# EAGLE schematic AWS (EAGLE 7.6.0)
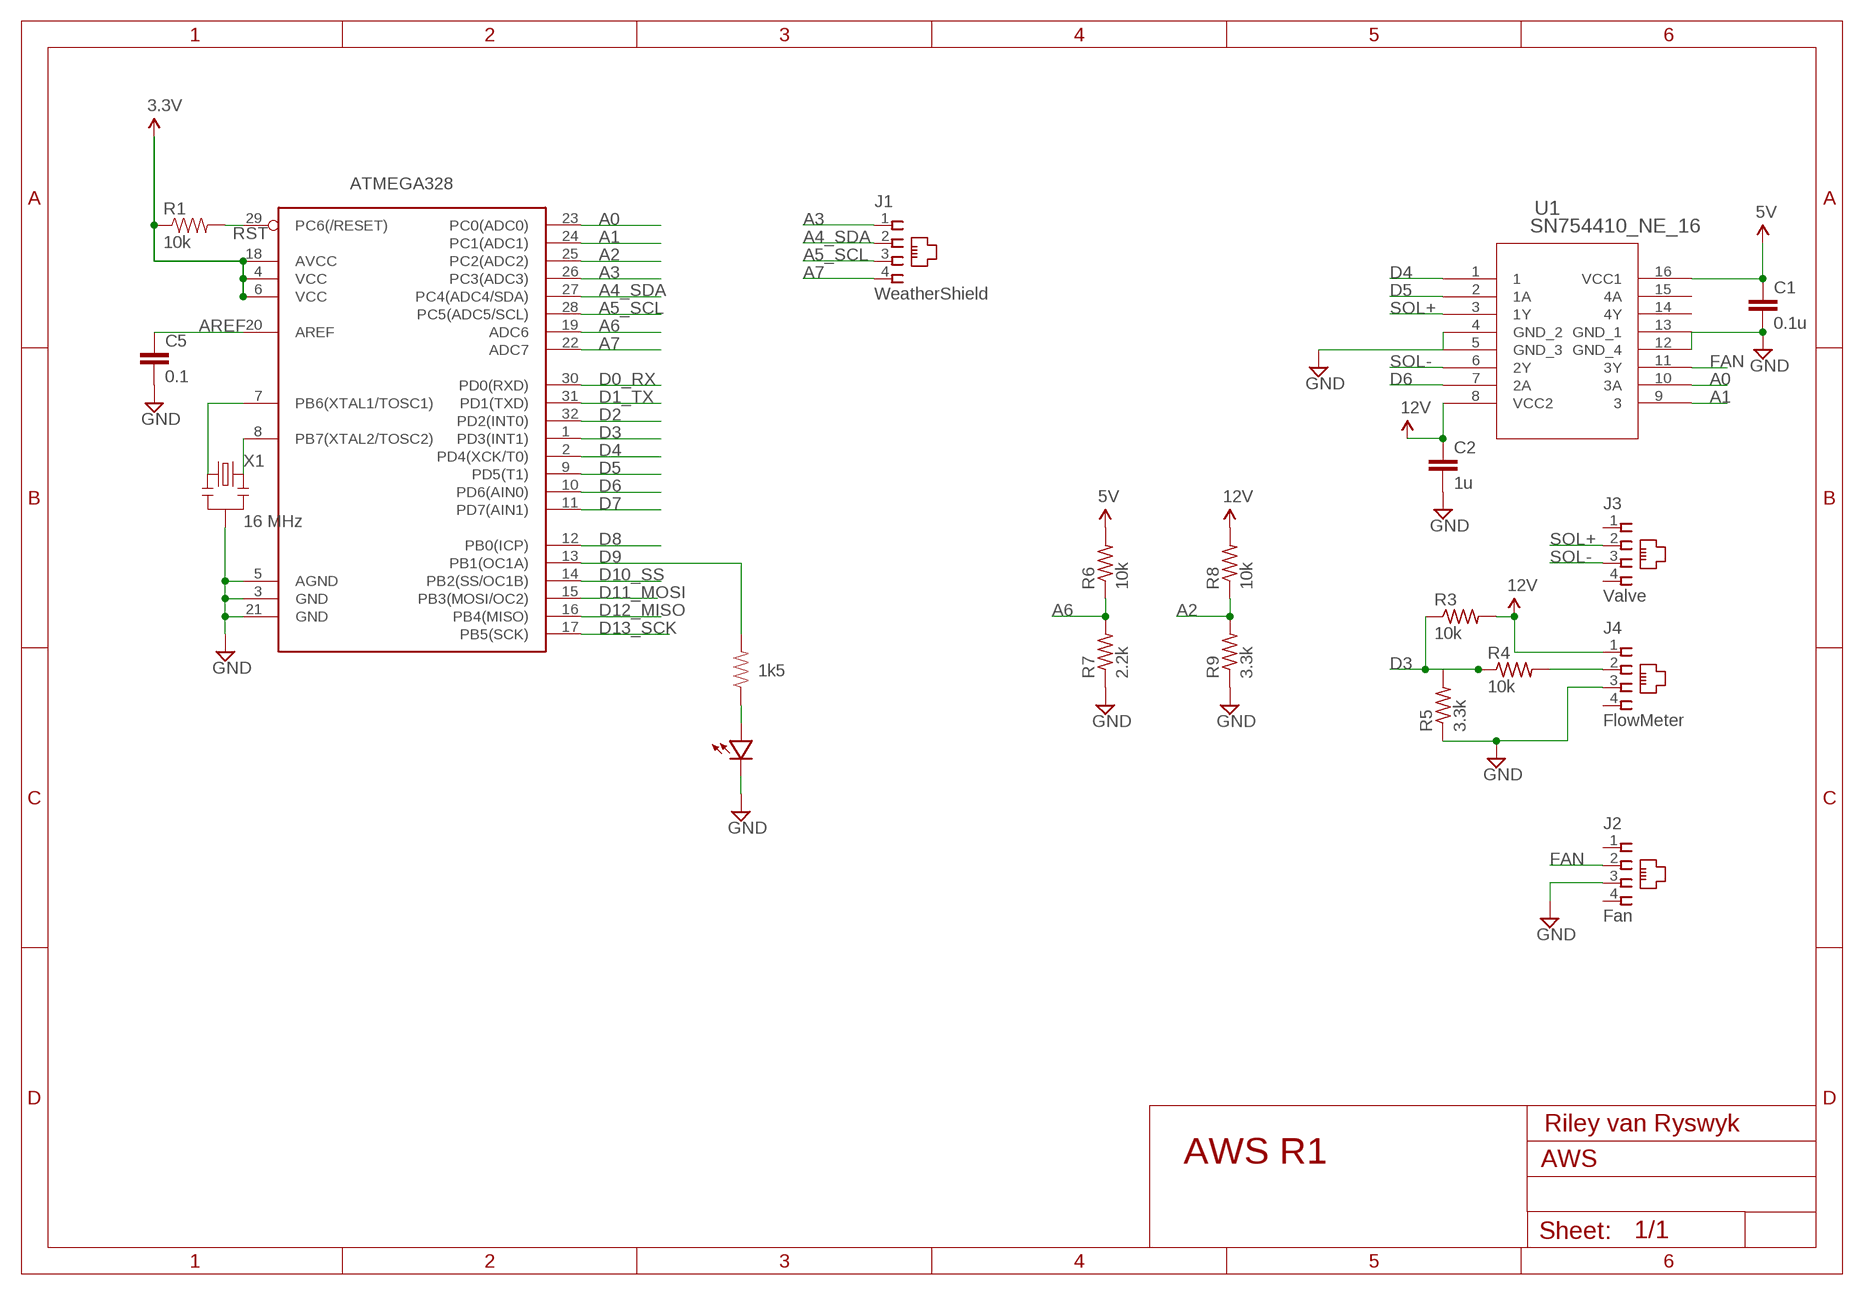
[diagram p0: schematic, sheet 1]

## Parts
ATMEGA328  ATMega-328  ATMEGA168/328TQFP32  [TQFP32-08]
C1  0.1u  C5/2.5  [C5B2.5]
C2  1u  C5/2.5  [C5B2.5]
C5  0.1  CAP0603-CAP  [0603-CAP]
J1  WeatherShield  215876-6  [215876-6]
J2  Fan  215876-6  [215876-6]
J3  Valve  215876-6  [215876-6]
J4  FlowMeter  215876-6  [215876-6]
R1  10k  RESISTOR0603-RES  [0603-RES]
R2  1k5  RESISTOR0603-RES  [0603-RES]
R3  10k  R-US_0204/2V  [0204V]
R4  10k  R-US_0204/2V  [0204V]
R5  3.3k  R-US_0204/2V  [0204V]
R6  10k  R-US_0204/2V  [0204V]
R7  2.2k  R-US_0204/2V  [0204V]
R8  10k  R-US_0204/2V  [0204V]
R9  3.3k  R-US_0204/2V  [0204V]
U1  SN754410_NE_16  [NE16]
U$2  LED0603  [0603-LED]
X1  16 MHz  RESONATORSMD  [RESONATOR-SMD]

## Nets
A0: ATMEGA328.23(PC0(ADC0)) U1.10(3A)
A1: ATMEGA328.24(PC1(ADC1)) U1.9
A2: ATMEGA328.25(PC2(ADC2)) R8.1 R9.2
A3: ATMEGA328.26(PC3(ADC3)) J1.1
A4_SDA: ATMEGA328.27(PC4(ADC4/SDA)) J1.2
A5_SCL: ATMEGA328.28(PC5(ADC5/SCL)) J1.3
A6: ATMEGA328.19(ADC6) R6.1 R7.2
A7: ATMEGA328.22(ADC7) J1.4
AREF: ATMEGA328.20(AREF) C5.1
D0_RX: ATMEGA328.30(PD0(RXD))
D1_TX: ATMEGA328.31(PD1(TXD))
D2: ATMEGA328.32(PD2(INT0))
D3: ATMEGA328.1(PD3(INT1)) R3.1 R4.1 R5.2
D4: ATMEGA328.2(PD4(XCK/T0)) U1.1
D5: ATMEGA328.9(PD5(T1)) U1.2(1A)
D6: ATMEGA328.10(PD6(AIN0)) U1.7(2A)
D7: ATMEGA328.11(PD7(AIN1))
D8: ATMEGA328.12(PB0(ICP))
D9: ATMEGA328.13(PB1(OC1A)) R2.2
D10_SS: ATMEGA328.14(PB2(SS/OC1B))
D11_MOSI: ATMEGA328.15(PB3(MOSI/OC2))
D12_MISO: ATMEGA328.16(PB4(MISO))
D13_SCK: ATMEGA328.17(PB5(SCK))
FAN: J2.2 U1.11(3Y)
GND [power]: ATMEGA328.3(GND) ATMEGA328.5(AGND) ATMEGA328.21(GND) C1.2 C2.2 C5.2 J2.3 J4.3 R5.1 R7.1 R9.1 U1.4(GND_2) U1.5(GND_3) U1.12(GND_4) U1.13(GND_1) U$2.MINUS X1.2
N$1: ATMEGA328.7(PB6(XTAL1/TOSC1)) X1.1
N$2: R2.1 U$2.PLUS
N$6: J4.2 R4.2
N$21: ATMEGA328.8(PB7(XTAL2/TOSC2)) X1.3
RST: ATMEGA328.29(PC6(/RESET)) R1.2
SOL+: J3.2 U1.3(1Y)
SOL-: J3.3 U1.6(2Y)
VCC: ATMEGA328.4(VCC) ATMEGA328.6(VCC) ATMEGA328.18(AVCC) C1.1 C2.1 J4.1 R1.1 R3.2 R6.2 R8.2 U1.8(VCC2) U1.16(VCC1) ; supply symbol labelled 3.3V, 5V, 12V
Unconnected: J2.1 J2.4 J3.1 J3.4 J4.4 U1.14(4Y) U1.15(4A)

## Notes on the sheet
- Riley van Ryswyk
- AWS R1

## Library data of the parts
ATMEGA328 = LowPowerLab:ATMEGA168/328: Atmel 32-pin 8-bit micro, 16k flash.
C1 C2 = capacitor-wima:C: CAPACITOR naming: grid - package width
C5 = LowPowerLab:CAP: Capacitor Standard 0603 ceramic capacitor, and 0.1" leaded capacitor.
J1-J4 = con-amp:215876-6: AMP connector
R1 R2 = LowPowerLab:RESISTOR: Resistor Basic schematic elements and footprints for 0603, 1206, and PTH resistors.
R3-R9 = rcl:R-US_: RESISTOR, American symbol
U1 = SN754410:SN754410_NE_16; DATASHEETURL: http://www.ti.com/lit/gpn/SN754410; DESCRIPTION: Quadruple Half-H Drivers; FAMILY_NAME: PERIPHERAL DRIVER AND ACTUATOR; GENERIC_PART_NUMBER: SN754410; INDUSTRY_STD_PKG_TYPE: PDIP; MANUFACTURER: Texas Instruments; PACKAGE_DESIGNATOR: NE; PIN_COUNT: 16
U$2 = LowPowerLab:LED
X1 = SparkFun:RESONATOR: Resonator Small SMD resonator. This is the itty bitty 10/20MHz resonators with built in caps. CSTCE10M0G55 and CSTCE20M0V53. Footprint has been reviewed closely but hasn't been tested yet.

## Module SOLENOID
Ports: 

### Library data of the parts

## Net classes
1 power: width 0.381 mm, clearance 0.254 mm